# Altium schematic sheet Camera.SchDoc
size B; DocumentNumber: 4; SheetNumber: 4; SheetTotal: 7; ENG_APP_DATE: --/--/--; DSN_APP_DATE: --/--/--; CHK_APP_DATE: --/--/--
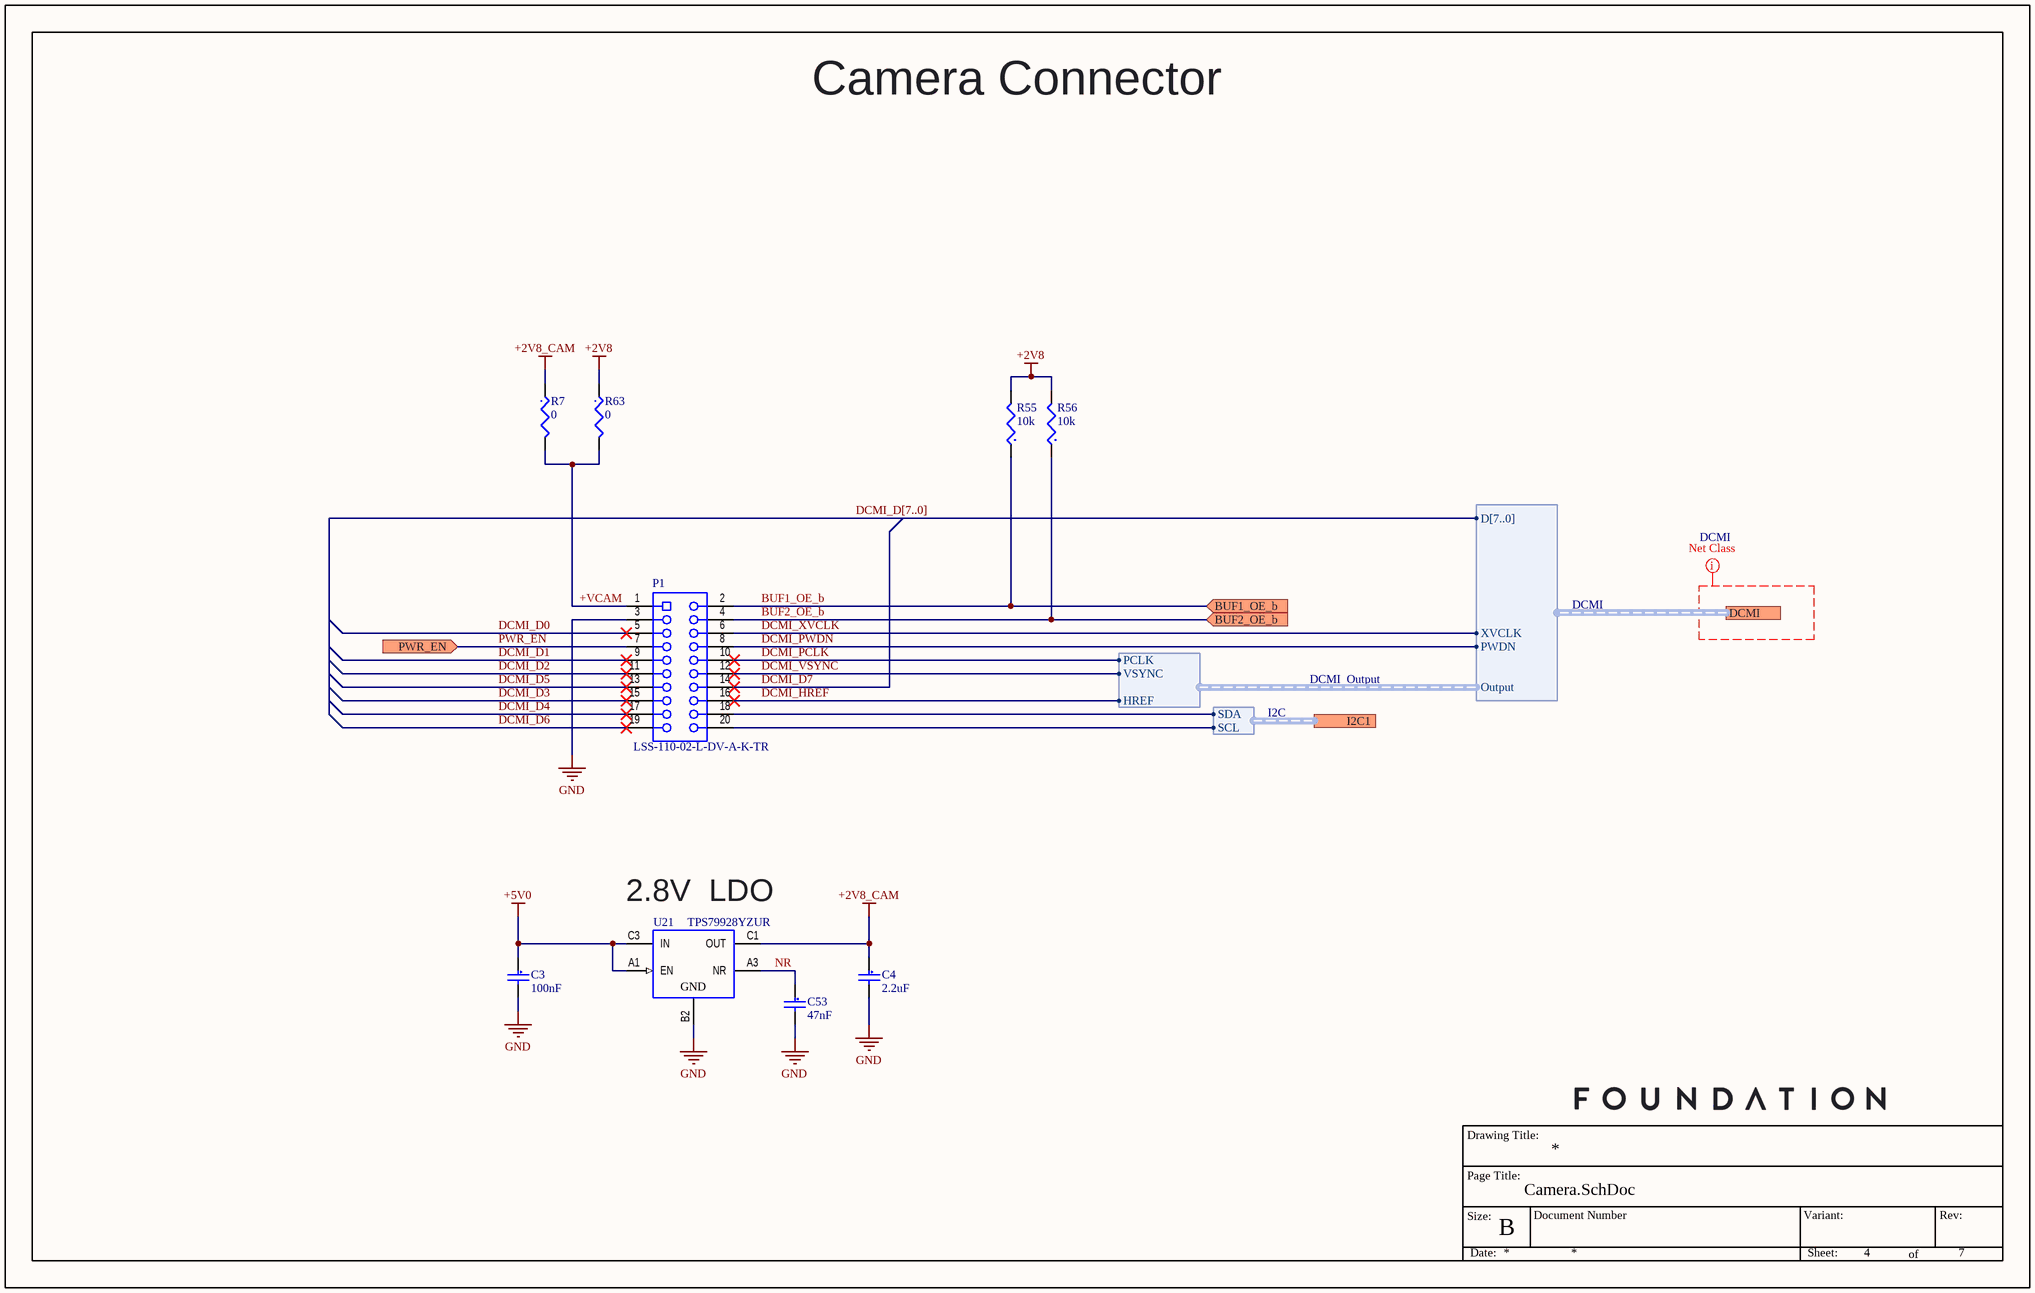
[diagram p0: Camera.SchDoc]

## Parts
C3  Capacitance: 100nF  [CAPC0402(1005)55_L]  (hidden comment: CAP CER 0.1uF 16V 10% X7R 0402)
C4  Capacitance: 2.2uF  [CAPC0402(1005)55_L]  (hidden comment: CAP CER 2.2uF 6.3V 10% X5R 0402)
C53  Capacitance: 47nF  [CAPC0402(1005)55_L]  (hidden comment: CAP CER 0.047uF 10V 10% X7R 0402)
P1  LSS-110-02-L-DV-A-K-TR  [SMTC - LSS-110-02-L-DV-A_V]
R7  Resistance: 0  [RESC0402(1005)_L]  (hidden comment: RES 0 OHM JUMPER 1/16W 0402)
R55  Resistance: 10k  [RESC0402(1005)_L]  (hidden comment: RES 10K 1/16W 1% 0402)
R56  Resistance: 10k  [RESC0402(1005)_L]  (hidden comment: RES 10K 1/16W 1% 0402)
R63  Resistance: 0  [RESC0402(1005)_L]  (hidden comment: RES 0 OHM JUMPER 1/16W 0402)
U21  TPS79928YZUR  [TI - DSBGA-YZU-5_V]

## Ports
BUF1_OE_b (in), BUF2_OE_b (in), DCMI (harness DCMI), I2C1 (harness I2C), PWR_EN (in)

## Harnesses
DCMI: Output, D[7..0], XVCLK, PWDN
DCMI_Output: HREF, PCLK, VSYNC
I2C: SCL, SDA

## Nets
+2V8: R55.2 R56.2 R63.1
+2V8_CAM: C4.1 R7.1 U21.C1(OUT)
+5V0: C3.1 U21.A1(EN) U21.C3(IN)
GND: C3.2 C4.2 C53.2 P1.3 U21.B2(GND)
+VCAM: P1.1 R7.2 R63.2
BUF1_OE_b: P1.2 R55.1 ; port BUF1_OE_b
BUF2_OE_b: P1.4 R56.1 ; port BUF2_OE_b
DCMI_D0: P1.5
DCMI_D1: P1.9
DCMI_D2: P1.11
DCMI_D3: P1.15
DCMI_D4: P1.17
DCMI_D5: P1.13
DCMI_D6: P1.19
DCMI_D7: P1.14
DCMI_HREF: P1.16 ; harness DCMI_Output.HREF
DCMI_PCLK: P1.10 ; harness DCMI_Output.PCLK
DCMI_PWDN: P1.8 ; port DCMI.PWDN
DCMI_VSYNC: P1.12 ; harness DCMI_Output.VSYNC
DCMI_XVCLK: P1.6 ; port DCMI.XVCLK
NR: C53.1 U21.A3(NR)
PWR_EN: P1.7 ; port PWR_EN
NetP1_18: P1.18 ; port I2C1.SDA
NetP1_20: P1.20 ; port I2C1.SCL

## Buses and harness runs
bus DCMI_D[7..0]

## Layout directives
net class DCMI: (no net found under the mark)

## Notes on the sheet
- Camera Connector
- (near U21) 2.8V  LDO
- Drawing Title:
- Page Title:
- Size:
- B
- Document Number
- Variant:
- Rev:
- Date:
- Sheet:
- of

## Library data of the parts
C3 = CMP-CAP-00002-2: 0.1µF ±10% 16V Ceramic Capacitor X7R 0402 (1005 Metric); Insulation Resistance: 10GR; Material: Ceramic; Tolerance: 10%; REACH SVHC: No SVHC; Radiation Hardening: No; Case Code (Metric): 1005; Height: 0.5mm; Depth: 0.5mm; Min Operating Temperature: -55°C; Max Operating Temperature: 125°C; Lead Free: Lead Free; Thickness: 0.022inch; Length: 1mm; Voltage Rating (DC): 16V; Dielectric Material: Ceramic; Packaging: Tape and Reel; Case/Package: 0402; Width: 0.5mm; Termination: SMD/SMT; Voltage Rating: 16V; Mount: Surface Mount; Case Code (Imperial): 0402; Package Quantity: 1; Dielectric: X7R; Number of Pins: 2; Voltage: 16V
C4 = CMP-CAP-00042-1: 2.2µF ±10% 6.3V Ceramic Capacitor X5R 0402 (1005 Metric); Lead Free: Lead Free; Tolerance: 10%; Width: 0.02inch; Number of Pins: 2; Contact Plating: Tin,Matte; Max Operating Temperature: 85°C; Termination: SMD/SMT; Voltage Rating: 6.3V; Thickness: 0.022inch; Case Code (Imperial): 0402; Case Code (Metric): 1005; Radiation Hardening: No; Package Quantity: 1; Mount: Surface Mount; Length: 1mm; Case/Package: 0402; REACH SVHC: No SVHC; Packaging: Tape and Reel; Min Operating Temperature: -55°C; Dielectric: X5R; Depth: 0.5mm; Voltage Rating (DC): 6.3V
C53 = CMP-CAP-00056-1: 0.047µF ±10% 10V Ceramic Capacitor X7R 0402 (1005 Metric); Number of Terminals/Pins: 2; Multilayer: Yes; Height: 0.5mm; Package Shape: Rectangular; Positive Tolerance: 10%; Max Operating Temperature: 125°C; Termination: Wraparound; Capacitor Type: Ceramic; Width: 0.5mm; Negative Tolerance: 10%; Rated DC Voltage (URdc): 10V; Length: 1mm; Mount: Surface Mount; Size Code: 0402; JESD-609 Code: e3; Temperature Characteristics Code: X7R; Min Operating Temperature: -55°C; Terminal Finish: Nickel; Package Style: SMTMeter; Packaging: Tape and Reel; Dielectric Material: Ceramic
P1 = CMP-CON-0021-4: 20 Position Connector Self Mating, Non-Gendered Surface Mount Gold; Number of Contacts: 20; Pitch: 0.635mm; Termination: Solder; Radiation Hardening: No; Number of Rows: 2; Packaging: Bulk; Contact Plating: Gold
R7 R63 = CMP-RES-00014-4: 0 Ohms Jumper 0.063W, 1/16W Chip Resistor 0402 (1005 Metric); Temperature Coefficient: 200ppm/°C; Power Rating: 62.5mW; Max Power Dissipation: 63mW; Tolerance: 5%; Voltage Rating: 50V; Lead Free: Lead Free; Height: 0.016inch; Military Standard: Not; Max Operating Temperature: 155°C; Features: Moisture Resistant; Case/Package: 0402; Contact Plating: Tin,Matte; Composition: Thick Film; Number of Terminations: 2; Case Code (Imperial): 0402; Package Quantity: 1; REACH SVHC: Unknown; Radiation Hardening: No; Case Code (Metric): 1005; Width: 0.02inch; Termination: SMD/SMT; Min Operating Temperature: -55°C; Length: 1mm; Packaging: Tape and Reel; Depth: 0.5mm
R55 R56 = CMP-RES-00006-3: 10 kOhms ±1% 0.063W, 1/16W Chip Resistor 0402 (1005 Metric); Voltage Rating (DC): 50V; Power Rating: 63mW; Temperature Coefficient: 100ppm/°C; Width: 0.02inch; Max Operating Temperature: 155°C; Case Code (Imperial): 0402; Mount: Surface Mount; Number of Terminations: 2; Military Standard: Not; Height: 0.35mm; Packaging: Tape and Reel; Lead Free: Lead Free; Case/Package: 0402; Composition: Thick Film; Weight: 2.3E-05oz; Radiation Hardening: No; Max Power Dissipation: 63mW; Contact Plating: Tin; Depth: 0.5mm; Package Quantity: 10; Tolerance: 1%; Length: 1mm; Min Operating Temperature: -55°C; REACH SVHC: Unknown; Voltage Rating: 50V; Case Code (Metric): 1005; Features: Automotive AEC-Q200; Termination: SMD/SMT; Number of Pins: 2
U21 = CMP-PMIC-00036-2: Linear Voltage Regulator IC  1 Output  200mA 5-DSBGA (1x1.37); Regulator Type: FIXED POSITIVE SINGLE OUTPUT LDO REGULATOR; Number of Outputs: 1; Input Voltage Absolute-Max: 7V; Voltage Tolerance-Max: 2%; Max Input Voltage: 6.5V; Dropout Voltage1-Max: 175mV; Dropout Voltage1-Nom: 100mV; Qualification Status: Not Qualified; Output Voltage1-Max: 2.856V; Number of Terminals/Pins: 5; Adjustability: FIXED; Output Voltage1-Min: 2.744V; Output Voltage1-Nom: 2.8V; Min Input Voltage: 2.975V; Package Code: VFBGA; Operating Temperature, TJ-Min: -40°C; Output Current1-Max: 200mA; Technology: BICMOS; Terminal Pitch: 0.5mm; Operating Temperature, TJ-Max: 125°C; Packaging: Tape and Reel; Surface Mount: Yes; Width: 1.195mm; Package Style: GRID ARRAY, VERY THIN PROFILE, FINE PITCHMeter; Terminal Position: BOTTOM; Terminal Form: Ball; Height - Seated (Max): 0.625mm; Terminal Finish: Copper; Package Shape: Rectangular; Moisture Sensitivity Level: 1; Number of Functions: 1; Length: 1.53mm; JESD-609 Code: e1; Peak Reflow Temperature (Cel): 260°C; ComponentLink1URL: https://www.ti.com/lit/ds/sbvs056k/sbvs056k.pdf; ComponentLink1Description: Datasheet